# EAGLE design PoE_Mag-revG (EAGLE 9.0.1)
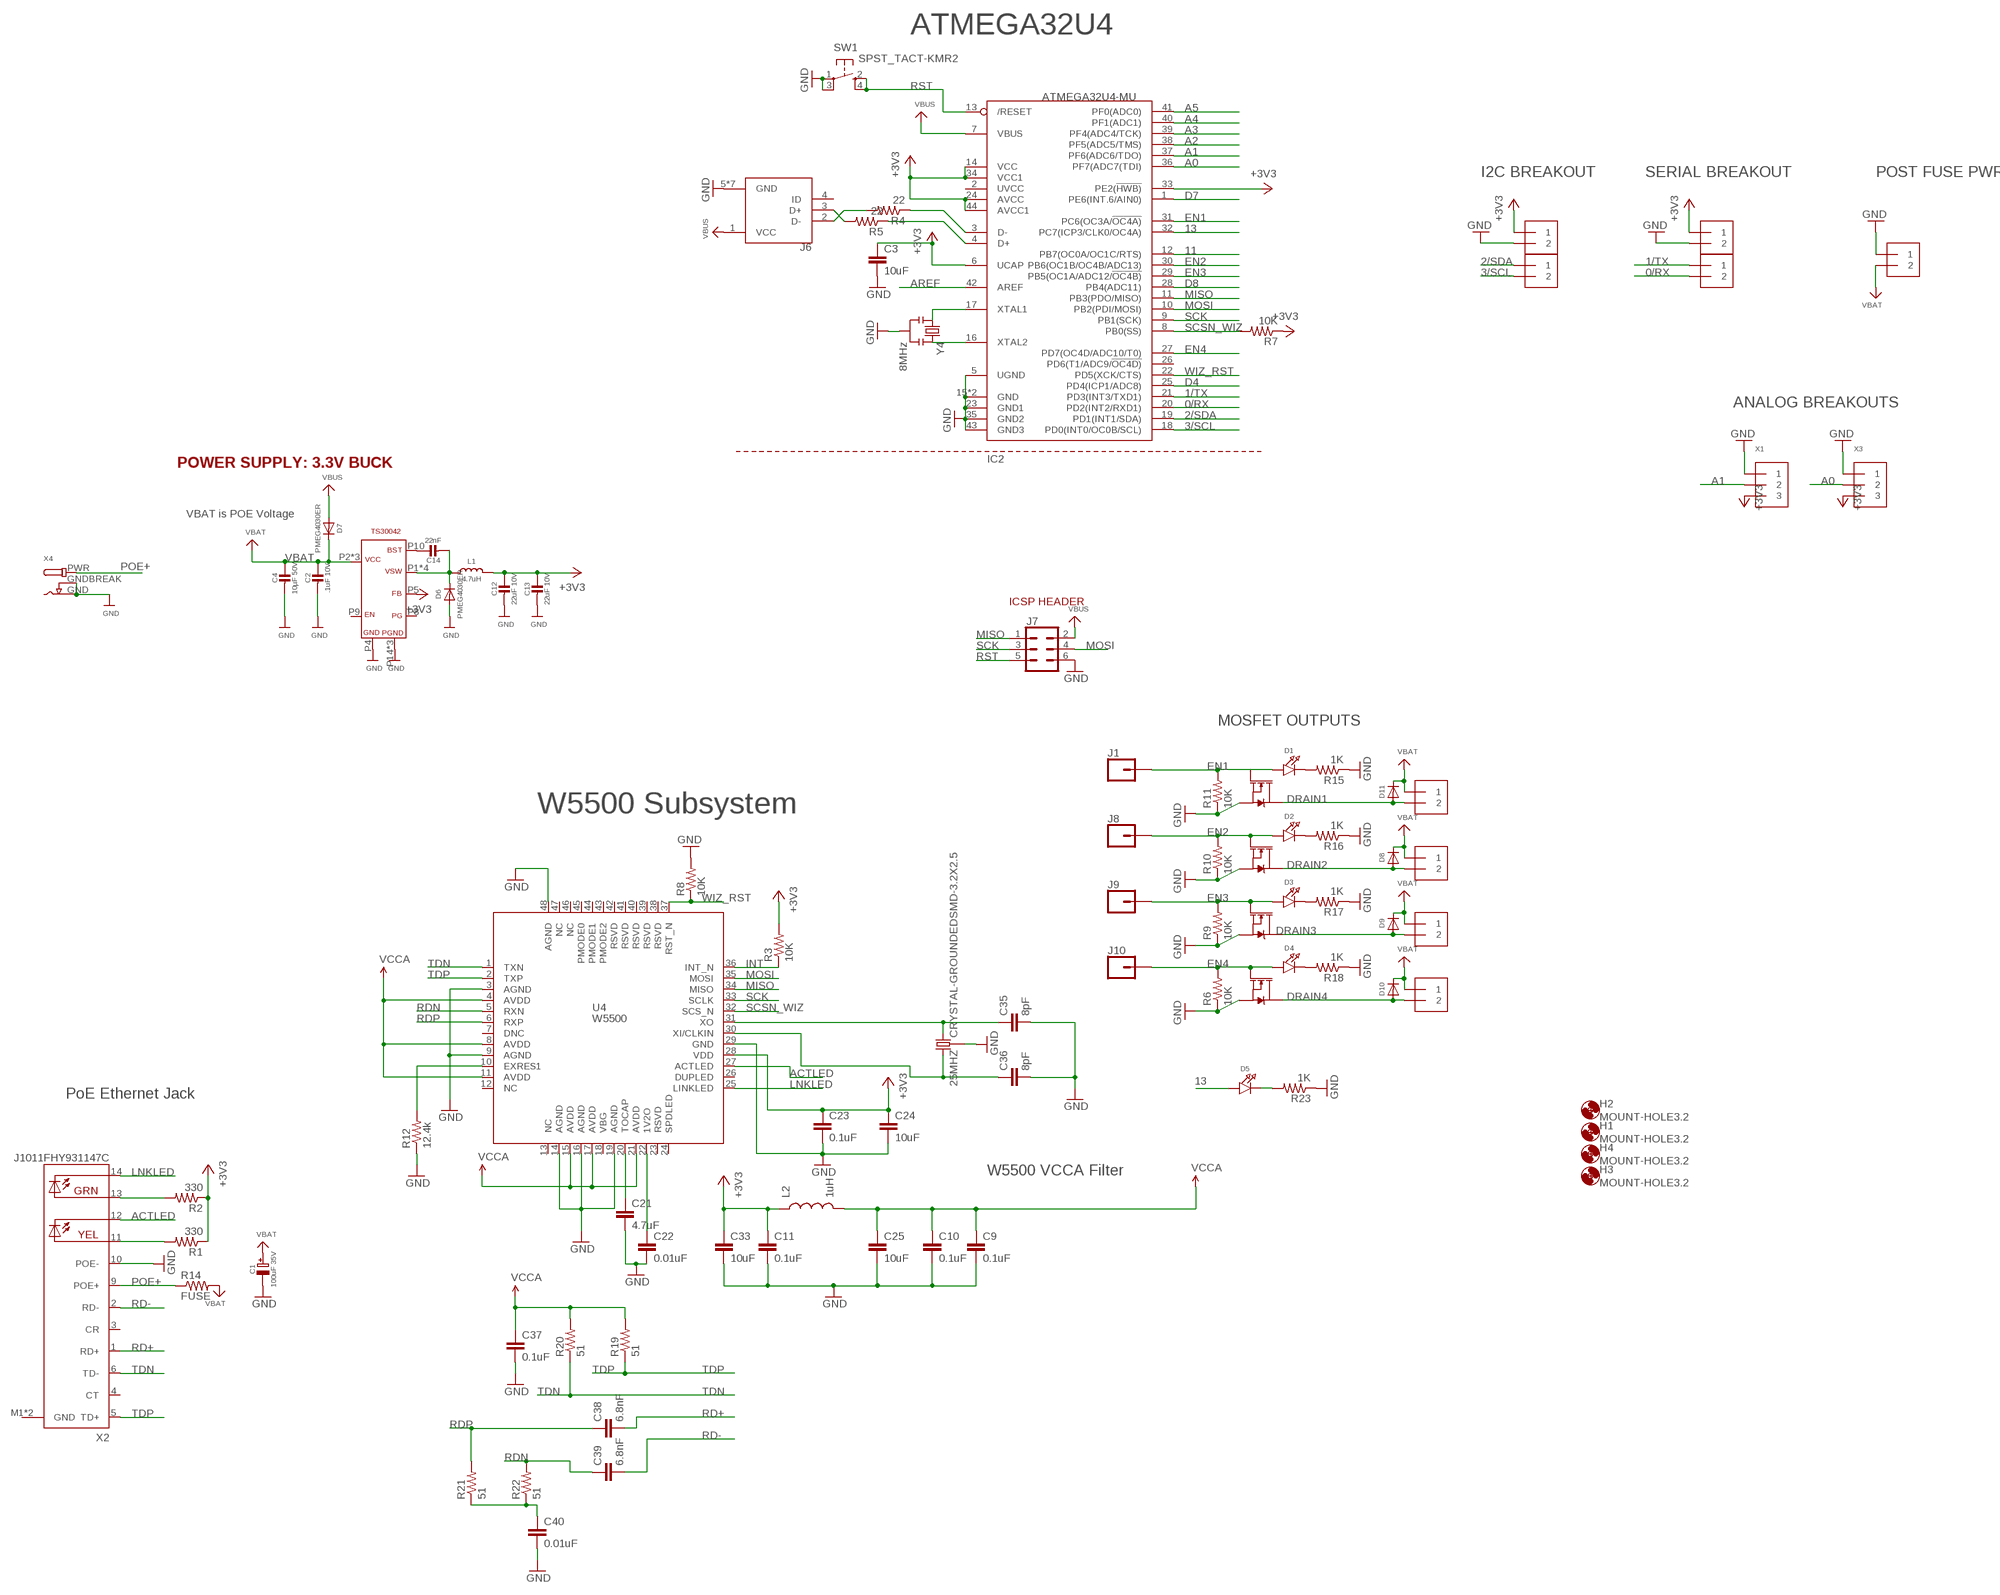
[diagram p0: schematic, sheet 1]

## Parts
25MHZ  CRYSTAL-GROUNDEDSMD-3.2X2.5  [CRYSTAL-SMD-3.2X2.5MM]
C1  100uF 35V  CAP_ELECTROLYTICPANASONIC_D  [PANASONIC_D]
C2  .1uF 10V  CAP_CERAMIC0603MINI  [0603-MINI]
C3  10uF  CAP0603-CAP  [0603-CAP]
C4  10µF 50V  CAP_CERAMIC_0805  [_0805]
C9  0.1uF  CAP0603-CAP  [0603-CAP]
C10  0.1uF  CAP0603-CAP  [0603-CAP]
C11  0.1uF  CAP0603-CAP  [0603-CAP]
C12  22uF 10V  CAP_CERAMIC0805-NOOUTLINE  [0805-NO]
C13  22uF 10V  CAP_CERAMIC0805-NOOUTLINE  [0805-NO]
C14  22nF  CAP_CERAMIC0603MINI  [0603-MINI]
C21  4.7uF  CAP0603-CAP  [0603-CAP]
C22  0.01uF  CAP0603-CAP  [0603-CAP]
C23  0.1uF  CAP0603-CAP  [0603-CAP]
C24  10uF  CAP0603-CAP  [0603-CAP]
C25  10uF  CAP0603-CAP  [0603-CAP]
C33  10uF  CAP0603-CAP  [0603-CAP]
C35  8pF  CAP0603-CAP  [0603-CAP]
C36  8pF  CAP0603-CAP  [0603-CAP]
C37  0.1uF  CAP0603-CAP  [0603-CAP]
C38  6.8nF  CAP0603-CAP  [0603-CAP]
C39  6.8nF  CAP0603-CAP  [0603-CAP]
C40  0.01uF  CAP0603-CAP  [0603-CAP]
D1  LED0805_NOOUTLINE  [CHIPLED_0805_NOOUTLINE]
D2  LED0805_NOOUTLINE  [CHIPLED_0805_NOOUTLINE]
D3  LED0805_NOOUTLINE  [CHIPLED_0805_NOOUTLINE]
D4  LED0805_NOOUTLINE  [CHIPLED_0805_NOOUTLINE]
D5  LED0805_NOOUTLINE  [CHIPLED_0805_NOOUTLINE]
D6  PMEG4030ER  DIODESOD-123  [SOD-123]
D7  PMEG4030ER  DIODESOD-123  [SOD-123]
D8  DIODESOD-123  [SOD-123]
D9  DIODESOD-123  [SOD-123]
D10  DIODESOD-123  [SOD-123]
D11  DIODESOD-123  [SOD-123]
H1  MOUNT-HOLE3.2  [3,2]
H2  MOUNT-HOLE3.2  [3,2]
H3  MOUNT-HOLE3.2  [3,2]
H4  MOUNT-HOLE3.2  [3,2]
IC2  ATMEGA32U4-MU  [TQFN44_7MM]
J1  CONN_01  [1X01]
J2  1X2-3.5MM  [1X2-3.5MM]
J3  1X2-3.5MM  [1X2-3.5MM]
J4  1X2-3.5MM  [1X2-3.5MM]
J5  1X2-3.5MM  [1X2-3.5MM]
J6  10103594-0001LF  [FCI_10103594-0001LF]
J7  CONN_03X2NO_SILK  [2X3-NS]
J8  CONN_01  [1X01]
J9  CONN_01  [1X01]
J10  CONN_01  [1X01]
J11  1X2-3.5MM  [1X2-3.5MM]
J14  1X2-3.5MM  [1X2-3.5MM]
J15  1X2-3.5MM  [1X2-3.5MM]
J16  1X2-3.5MM  [1X2-3.5MM]
J17  1X2-3.5MM  [1X2-3.5MM]
L1  4.7uH  INDUCTORTDK_VLC5045  [INDUCTOR_5X5MM_TDK_VLC5045]
L2  1uH  INDUCTOR0603  [0603]
Q1  35A/25V/8.5mΩ  MOSFET-NCH-FDD8780  [DPAK]
Q3  35A/25V/8.5mΩ  MOSFET-NCH-FDD8780  [DPAK]
Q5  35A/25V/8.5mΩ  MOSFET-NCH-FDD8780  [DPAK]
Q6  35A/25V/8.5mΩ  MOSFET-NCH-FDD8780  [DPAK]
R1  330  RESISTOR0603-RES  [0603-RES]
R2  330  RESISTOR0603-RES  [0603-RES]
R3  10K  RESISTOR0603-RES  [0603-RES]
R4  22  RESISTOR0603-RES  [0603-RES]
R5  22  RESISTOR0603-RES  [0603-RES]
R6  10K  RESISTOR0603-RES  [0603-RES]
R7  10K  RESISTOR0603-RES  [0603-RES]
R8  10K  RESISTOR0603-RES  [0603-RES]
R9  10K  RESISTOR0603-RES  [0603-RES]
R10  10K  RESISTOR0603-RES  [0603-RES]
R11  10K  RESISTOR0603-RES  [0603-RES]
R12  12.4k  RESISTOR0603-RES  [0603-RES]
R14  FUSE  RESISTOR0603-RES  [0603-RES]
R15  1K  RESISTOR0603-RES  [0603-RES]
R16  1K  RESISTOR0603-RES  [0603-RES]
R17  1K  RESISTOR0603-RES  [0603-RES]
R18  1K  RESISTOR0603-RES  [0603-RES]
R19  51  RESISTOR0603-RES  [0603-RES]
R20  51  RESISTOR0603-RES  [0603-RES]
R21  51  RESISTOR0603-RES  [0603-RES]
R22  51  RESISTOR0603-RES  [0603-RES]
R23  1K  RESISTOR0603-RES  [0603-RES]
SW1  SPST_TACT-KMR2  [KMR2]
U4  W5500  [W5500]
U$19  BUCK_CONVERTER  [QFN-16]
X1  TERMBLOCK_1X3  [TERMBLOCK_1X3-3.5MM]
X2  J1011FHY931147C  [HANRUN_POE]
X3  TERMBLOCK_1X3  [TERMBLOCK_1X3-3.5MM]
X4  DCBARRELPTH  [DCJACK_2MM_PTH]
Y4  8MHz  RESONATORSMD  [RESONATOR-SMD]

## Nets
0/RX: IC2.20(PD2(INT2/RXD1)) J17.2
1/TX: IC2.21(PD3(INT3/TXD1)) J17.1
2/SDA: IC2.19(PD1(INT1/SDA)) J15.1
3/SCL: IC2.18(PD0(INT0/OC0B/SCL)) J15.2
11: IC2.12(PB7(OC0A/OC1C/RTS))
13: D5.A IC2.32(PC7(ICP3/CLK0/OC4A))
+3V3: C3.1 C11.1 C12.1 C13.1 C23.1 C24.1 C33.1 IC2.6(UCAP) IC2.14(VCC) IC2.24(AVCC) IC2.33(PE2(!HWB)) IC2.34(VCC1) IC2.44(AVCC1) J14.1 J16.1 L1.P$2 L2.1 R1.1 R2.1 R3.2 R7.1 U4.28(VDD) U$19.P5(FB) X1.3 X3.3
A0: IC2.36(PF7(ADC7(TDI)) X3.2
A1: IC2.37(PF6(ADC6/TDO)) X1.2
A2: IC2.38(PF5(ADC5/TMS))
A3: IC2.39(PF4(ADC4/TCK))
A4: IC2.40(PF1(ADC1))
A5: IC2.41(PF0(ADC0))
ACTLED: U4.27(ACTLED) X2.12(YEL-C)
AREF: IC2.42(AREF)
D4: IC2.25(PD4(ICP1/ADC8))
D7: IC2.1(PE6(INT.6/AIN0))
D8: IC2.28(PB4(ADC11))
D+: IC2.4(D+) R5.1
D-: IC2.3(D-) R4.1
DRAIN1: D11.A J2.2 Q1.4(D)
DRAIN2: D8.A J3.2 Q3.4(D)
DRAIN3: D9.A J4.2 Q5.4(D)
DRAIN4: D10.A J5.2 Q6.4(D)
EN1: D1.A IC2.31(PC6(OC3A/!OC4A)) J1.1 Q1.1(G) R11.2
EN2: D2.A IC2.30(PB6(OC1B/OC4B/ADC13)) J8.1 Q3.1(G) R10.2
EN3: D3.A IC2.29(PB5(OC1A/ADC12/!OC4B)) J9.1 Q5.1(G) R9.2
EN4: D4.A IC2.27(PD7(OC4D/ADC10/T0)) J10.1 Q6.1(G) R6.2
GND: 25MHZ.2 25MHZ.4 C1.- C2.2 C3.2 C4.2 C9.2 C10.2 C11.2 C12.2 C13.2 C21.2 C22.2 C23.2 C24.2 C25.2 C33.2 C35.2 C36.2 C37.2 C40.2 D6.A IC2.5(UGND) IC2.15(GND) IC2.23(GND1) IC2.35(GND2) IC2.43(GND3) IC2.THERMAL(GND) J6.5(GND) J6.P1(GND) J6.P2(GND) J6.P3(GND) J6.P4(GND) J6.P5(GND) J6.P6(GND) J7.6 J11.1 J14.2 J16.2 Q1.3(S) Q3.3(S) Q5.3(S) Q6.3(S) R6.1 R8.2 R9.1 R10.1 R11.1 R12.1 R15.1 R16.1 R17.1 R18.1 R23.1 SW1.1(P) SW1.3(P1) U4.3(AGND) U4.9(AGND) U4.14(AGND) U4.16(AGND) U4.19(AGND) U4.29(GND) U4.48(AGND) U$19.P4(GND) U$19.P14(PGND) U$19.P15(PGND) U$19.PAD(PGND) X1.1 X2.10(POE-) X3.1 X4.GND X4.GNDBREAK Y4.2
INT: R3.1 U4.36(INT_N)
LNKLED: U4.25(LINKLED) X2.14(GRN-C)
MISO: IC2.11(PB3(PDO/MISO)) J7.1 U4.34(MISO)
MOSI: IC2.10(PB2(PDI/MOSI)) J7.4 U4.35(MOSI)
N$3: R2.2 X2.13(GRN-A)
N$4: R1.2 X2.11(YEL-A)
N$5: D1.C R15.2
N$6: J6.3(D+) R5.2
N$7: D2.C R16.2
N$8: D3.C R17.2
N$9: D4.C R18.2
N$10: D5.C R23.2
N$11: IC2.16(XTAL2) Y4.3
N$12: IC2.17(XTAL1) Y4.1
N$13: J6.2(D-) R4.2
N$14: C14.1 U$19.P10(BST)
N$16: C14.2 D6.C L1.P$1 U$19.P1(VSW) U$19.P12(VSW) U$19.P13(VSW) U$19.P16(VSW)
N$18: C21.1 U4.20(TOCAP)
N$19: C22.1 U4.22(1V2O)
N$20: R12.2 U4.10(EXRES1)
N$23: C40.1 R21.1 R22.1
N$25: 25MHZ.3 C35.1 U4.31(XO)
N$26: 25MHZ.1 C36.1 U4.30(XI/CLKIN)
POE+: R14.1 X2.9(POE+) X4.PWR
RD+: C38.2 X2.1(RD+)
RD-: C39.2 X2.2(RD-)
RDN: C39.1 R22.2 U4.5(RXN)
RDP: C38.1 R21.2 U4.6(RXP)
RST: IC2.13(/RESET) J7.5 SW1.2(S) SW1.4(S1)
SCK: IC2.9(PB1(SCK)) J7.3 U4.33(SCLK)
SCSN_WIZ: IC2.8(PB0(SS)) R7.2 U4.32(SCS_N)
TDN: R20.1 U4.1(TXN) X2.6(TD-)
TDP: R19.1 U4.2(TXP) X2.5(TD+)
VBAT: C1.+ C2.1 C4.1 D7.C D8.C D9.C D10.C D11.C J2.1 J3.1 J4.1 J5.1 J11.2 R14.2 U$19.P2(VCC) U$19.P3(VCC) U$19.P11(VCC)
VBUS: D7.A IC2.7(VBUS) J6.1(VCC) J7.2
VCCA: C9.1 C10.1 C25.1 C37.1 L2.2 R19.2 R20.2 U4.4(AVDD) U4.8(AVDD) U4.11(AVDD) U4.15(AVDD) U4.17(AVDD) U4.21(AVDD)
WIZ_RST: IC2.22(PD5(XCK/CTS)) R8.1 U4.37(RST_N)
Unconnected: IC2.2(UVCC) IC2.26(PD6(T1/ADC9/!OC4D)) J6.4(ID) U4.7(DNC) U4.12(NC) U4.13(NC) U4.18(VBG) U4.23(RSVD) U4.24(SPDLED) U4.26(DUPLED) U4.38(RSVD) U4.39(RSVD) U4.40(RSVD) U4.41(RSVD) U4.42(RSVD) U4.43(PMODE2) U4.44(PMODE1) U4.45(PMODE0) U4.46(NC) U4.47(NC) U$19.P8(PG) U$19.P9(EN) X2.3(CR) X2.4(CT)

## Notes on the sheet
- ATMEGA32U4
- I2C BREAKOUT | SERIAL BREAKOUT | POST FUSE PWR
- ANALOG BREAKOUTS
- POWER SUPPLY: 3.3V BUCK
- VBAT is POE Voltage
- ICSP HEADER
- MOSFET OUTPUTS
- W5500 Subsystem
- PoE Ethernet Jack
- W5500 VCCA Filter

## Power pins joined to a net without a drawn wire
GND: X2.M1(GND) X2.M2(GND)

## Library data of the parts
25MHZ = SparkFun-Clocks:CRYSTAL-GROUNDED: Crystals w/ Ground Pin (Generic) These are passive quartz crystals, which can be used as a clock source for a microcontroller. Crystal's are usually two-terminal devices. A third terminal may be optionally connected to ground, as recommended by the manufaturer.
C1 = microbuilder:CAP_ELECTROLYTIC: Electrolytic Capacitors SMT PANASONIC_C - Size C Panasonic Electrolytic Aluminum Capacitor 47µF 16V 20% Electrolytic Capacitor [Digikey: PCE3890TR-ND] PANASONIC_D - Size D Panasonic Electrolytic Aluminum Capacitor 100µF 25V 20% Electrolytic Capacitor [Digikey: PCE3898TR-ND] PTH 3.5 mm grid, 8 mm diameter ... 3.5 mm grid, 10 mm diameter ...
C2 C4 C12-C14 = microbuilder:CAP_CERAMIC: Ceramic Capacitors For new designs, use the packages preceded by an '_' character since they are more reliable: The following footprints should be used on most boards: _0402 - Standard footprint for regular board layouts _0603 - Standard footprint for regular board layouts _0805 - Standard footprint for regular board layouts _1206 - Standard footprint for regular board layouts For extremely tight-pitch boards where space is at a premium, the following 'micro-pitch' footprints can be used (smaller pads, no silkscreen outline, etc.): _0402MP - Micro-pitch footprint for very dense/compact boards _0603MP - Micro-pitch footprint for very dense/compact boards _0805MP - Micro-pitch footprint for very dense/compact boards _1206MP - Micro-pitch footprint for very dense/compact boards
C3 C9-C11 C21-C25 C33 C35-C40 = SparkFun-Passives:CAP: Capacitor Standard 0603 ceramic capacitor, and 0.1" leaded capacitor.
D1-D5 = microbuilder:LED: LED 0603 - 0603 Surface Mount Package 2mA: Green LED - Low Power (3.9mcd, 2ma, 1.7Vf) - Digikey: 475-2709-2-ND Orange LED - Low Power (9.8mcd, 2ma, 1.8Vf) - Digikey: 475-1194-2-ND Red LED - Low Power (5mcd, 2ma, 1.8Vf) - Digikey: 475-1195-2-ND Yellow LED - Low Power (7mcd, 2ma, 1.8Vf) - Digikey: 475-1196-2-ND 5mA: Blue LED - Low Power (17mcd, 5ma, 2.9Vf) - Digikey: LNJ937W8CRACT-ND 0805 - 0805 Surface Mount Package 2mA: Red LED (8.8mcd, 2mA, 1.8Vf, Clear) - Low Power [Digikey: 475-2510-1-ND] Green LED (5mcd, 2mA, 1.8Vf, Clear) - Low Power [Digikey: 475-2730-1-ND] Yellow LED (11.3mcd, 2mA, 1.8Vf, Clear) - Low Power [Digikey: 475-2555-1-ND] 20mA: Red LED (104mcd, 20mA, Diffused) - LS R976 [Digikey: 475-1278-6-ND] Red LED (12mcd, 20mA, 2.0Vf, Clear) - APT2012EC [Digikey: 754-1128-1-ND] Green LED (15mcd, 20mA, 2.2Vf, Clear) - APT2012GC [Digikey: 754-1131-1-ND] Orange LED (160mcd, 20mA, 2.1Vf, Clear) - APT2012SECK [Digikey: 754-1130-1-ND] 1206 - 1206 Surface Mount Package Green LED (26mcd, 20mA, Diffused) - LG N971 [Digikey: 475-1407-6-ND] Red LED (15mcd, 20mA, Diffused) - LH N974 [Digikey: 475-1416-6-ND] Cree - Cree High-Power Surface Mount LEDs XPEBWT-L1-0000-00D50 - White 111lm 350mA 2.9Vf 6200K 110° XTEAWT-00-0000-00000LEE3 - White 114lm 350mA 2.85Vf 5000K 115° Everlight - Everlight 45-21 Series Surface Mount LEDs 45-21/QK2C-B2832AC2CB2/2T - Warm White 2000mcd 20mA 3.25Vf 3050K 120° 45-21/LK2C-B38452C4CB2/2T - Nuetral White 2000mcd 20mA 3.25Vf 4150K 120° 45-21/LK2C-B50634C6CB2/2T - Cold White 2200mcd 20mA 3.25Vf 5650K 120° PLCC2 Reverse Mount LS T77K-J1L2-1-0-2-R18-Z - Red 11.25mcd 2mA 1.8Vf 630nm 120° LO T77K-L1M2-24-Z - Orange 19.6mcd 2mA 1.8Vf 606nm 120° LY T77K-K2M1-26-Z - Yellow 15.7mcd 2mA 1.8Vf 587nm 120°
D6-D11 = microbuilder:DIODE: Diode SMA Model Volts Amps Type Vf Ir Digikey # Notes SSA34-E3 40V 3A Schottky 480mV @ 3A 200uA @ 40V SSA34-E3/61TGITR-ND CDBA120-G 20V 1A Schottky 500mV @ 1A 500uA @ 20V 641-1014-6-ND REEL MBRA210 10V 2A Schottky 350mV @ 2A 700uA @ 10V MBRA210LT3 SOD-123 Model Volts Amps Type Vf Ir Order # Notes BAT54T1G 30V 200mA Schottky 800mV @ 200mA 2uA @ 25V BAT54T1GOSTR-ND B0530W 30V 500mA Schottky 430mV @ 500mA 130uA @ 30V B0530W-FDICT-ND REEL MBR120 20V 1A Schottky 340mV @ 1A MBR120VLSFT1GOSCT-ND SOD-323 Model Volts Amps Type Vf Ir Order # Notes PMEG2005EJ 20V 500mA Schottky 355mV @ 500mA 568-4110-1-ND ZLLS410 10V 570mA Schottky 380mV @ 570mA ZLLS410CT-ND 1N4148WS 75V 150mA Silicon/Simple 1V 1N4148WSFSCT-ND REEL SOD-523 Model Volts Amps Type Vf Ir Order # Notes BAT54XV2 30V 200mA Schottky 0.8V @ 100mA BAT54XV2CT-ND TB751S 30V 30mA Schottky RB751S-40TE61CT-ND SOT23-R/W (R = Solder Paste/Reflow Ovens, W = Hand-Soldering) Model Volts Amps Type Vf Ir Order # Notes BAT54FILM 40V 300mA Schottky 497-7162-1-ND POWERDI-5 Model Volts Amps Type Vf Ir Order # Notes PDS560 60V 5A Schottky 670mV @ 5A 150uA @ 60V PDS560DICT-ND
H1-H4 = holes:MOUNT-HOLE: MOUNTING HOLE with drill center marker
IC2 = microbuilder:ATMEGA32U4: http://www.ladyada.net/library/eagle
J1 J8-J10 = SparkFun-Connectors:CONN_01: Single connection point. Often used as Generic Header-pin footprint for 0.1 inch spaced/style header connections On any of the 0.1 inch spaced packages, you can populate with these: Break Away Headers - Straight <https://www.sparkfun.com/products/116> (PRT-00116) Break Away Male Headers - Right Angle <https://www.sparkfun.com/products/553> (PRT-00553) Female Headers <https://www.sparkfun.com/products/115> (PRT-00115) Break Away Headers - Machine Pin <https://www.sparkfun.com/products/117> (PRT-00117) Break Away Female Headers - Swiss Machine Pin <https://www.sparkfun.com/products/743> (PRT-00743) This device is also useful as a general connection point to wire up your design to another part of your project. Our various solder wires solder well into these plated through hole pads. Hook-Up Wire - Assortment (Stranded, 22 AWG) <https://www.sparkfun.com/products/11375> (PRT-11375) Hook-Up Wire - Assortment (Solid Core, 22 AWG) <https://www.sparkfun.com/products/11367> (PRT-11367) View the entire wire category on our website here <https://www.sparkfun.com/categories/141> Special notes: SMTSO-256-ET is a "flush mount" nut for a 4-40 screw. We mostly use this on specialty testbeds; it is a nice way to connect hardware to your PCB at an adjustable hieght. Also note, the SNAP packages are for using a snappable style connector. We sell a baggie of snaps and they are also used on two LilyPad designs: Snap Assortment - 30 pack (male and female) <https://www.sparkfun.com/products/11347> (DEV-11347) LilyPad Arduino SimpleSnap <https://www.sparkfun.com/products/10941> (DEV-10941) LilyPad SimpleSnap Protoboard <https://www.sparkfun.com/products/10940> (DEV-10940)
J2-J5 J11 J14-J17 = adafruit:1X2: 3.5mm Terminal block http://www.ladyada.net/library/pcb/eaglelibrary.html
J6 = 10103594-0001LF:10103594-0001LF: Conn Micro USB Type B RCP 5 POS 0.65mm Solder RA SMD 5 Terminal 1 Port T/R; AVAILABILITY: Good; DESCRIPTION: Conn Micro USB Type B RCP 5 POS 0.65mm Solder RA SMD 5 Terminal 1 Port T/R; MF: FCI; MP: 10103594-0001LF; PACKAGE: None; PRICE: 0.40 USD
J7 = SparkFun-Connectors:CONN_03X2: Multi connection point. Often used as Generic Header-pin footprint for 0.1 inch spaced/style header connections You can populate with any combo of single row headers, but if you'd like an exact match, check these: Header - 2x3 (Male, 0.1") <https://www.sparkfun.com/products/12807> (PRT-12807) Header - 2x3 (Female, 0.1") <https://www.sparkfun.com/products/13010> (PRT-13010) 2x3 Pin Shrouded Header <https://www.sparkfun.com/products/10877> (PRT-10877) On any of the 0.1 inch spaced packages, you can populate with these: Break Away Headers - Straight <https://www.sparkfun.com/products/116> (PRT-00116) Break Away Male Headers - Right Angle <https://www.sparkfun.com/products/553> (PRT-00553) Female Headers <https://www.sparkfun.com/products/115> (PRT-00115) Break Away Headers - Machine Pin <https://www.sparkfun.com/products/117> (PRT-00117) Break Away Female Headers - Swiss Machine Pin <https://www.sparkfun.com/products/743> (PRT-00743) Special note: the shrouded connector mates well with our 3x2 ribbon cables: Ribbon Crimp Connector - 6-pin (2x3, Female) <https://www.sparkfun.com/products/10651> (PRT-10651) Ribbon Cable - 6 wire (15ft) <https://www.sparkfun.com/products/10646> (PRT-10646)
L1 = microbuilder:INDUCTOR: Inductors
L2 = SparkFun-Passives:INDUCTOR: Inductors
Q1 Q3 Q5 Q6 = SparkFun-DiscreteSemi:MOSFET-NCH: N-channel MOSFETs Voltage controlled devices that allow control of high current outputs. SparkFun Products: SparkFun OpenScale <https://www.sparkfun.com/products/13261> SparkFun Digital Sandbox <https://www.sparkfun.com/products/12651> SparkFun Monster Moto Shield <https://www.sparkfun.com/products/10182> SparkFun MOSFET Power Controller <https://www.sparkfun.com/products/11214>; PROD_ID: TRANS-09984
R1-R12 R14-R23 = SparkFun-Passives:RESISTOR: Resistor Basic schematic elements and footprints for 0603, 1206, and PTH resistors.
SW1 = adafruit:SPST_TACT: SMT 6mm switch, EVQQ2 series http://www.ladyada.net/library/eagle
U4 = W5500:W5500
U$19 = Heep:BUCK_CONVERTER
X1 X3 = microbuilder:TERMBLOCK_1X3: 3.5mm Terminal block http://www.ladyada.net/library/pcb/eaglelibrary.html
X2 = Heep:J1011F: PULSEJACK (TM) 1x1 Tab-UP RJ45 10/100 Base-TX RJ45 1x1 Tab-UP with LEDs 8-pin (J1 series) and 6-pin (JP series) integrated magnetics connector, designed to support applications, such as ADSL modems, LAN-on-Motherboard, and Hub and Switches. Source: www.pulseeng.com .. PulseJack-J402.pdf
X4 = microbuilder:DCBARREL: DC Barrel Jack DCJACK_1.3MM_PTH - Through Hole 1.3mm Jack (4UConnector: 05536) DCJACK_2MM_PTH - Through Hole 2.0/2.1 Jack (4UConnector: 05537) DCJACK_2MM_SMT - SMT 2.0/2.1mm Jack(4UConnector: 03267)
Y4 = SparkFun:RESONATOR: Resonator Small SMD resonator. This is the itty bitty 10/20MHz resonators with built in caps. CSTCE10M0G55 and CSTCE20M0V53. Footprint has been reviewed closely but hasn't been tested yet.

## Net classes
3 usbvcc: width 0.305 mm, drill 0.483 mm, clearance 0.203 mm

## Board
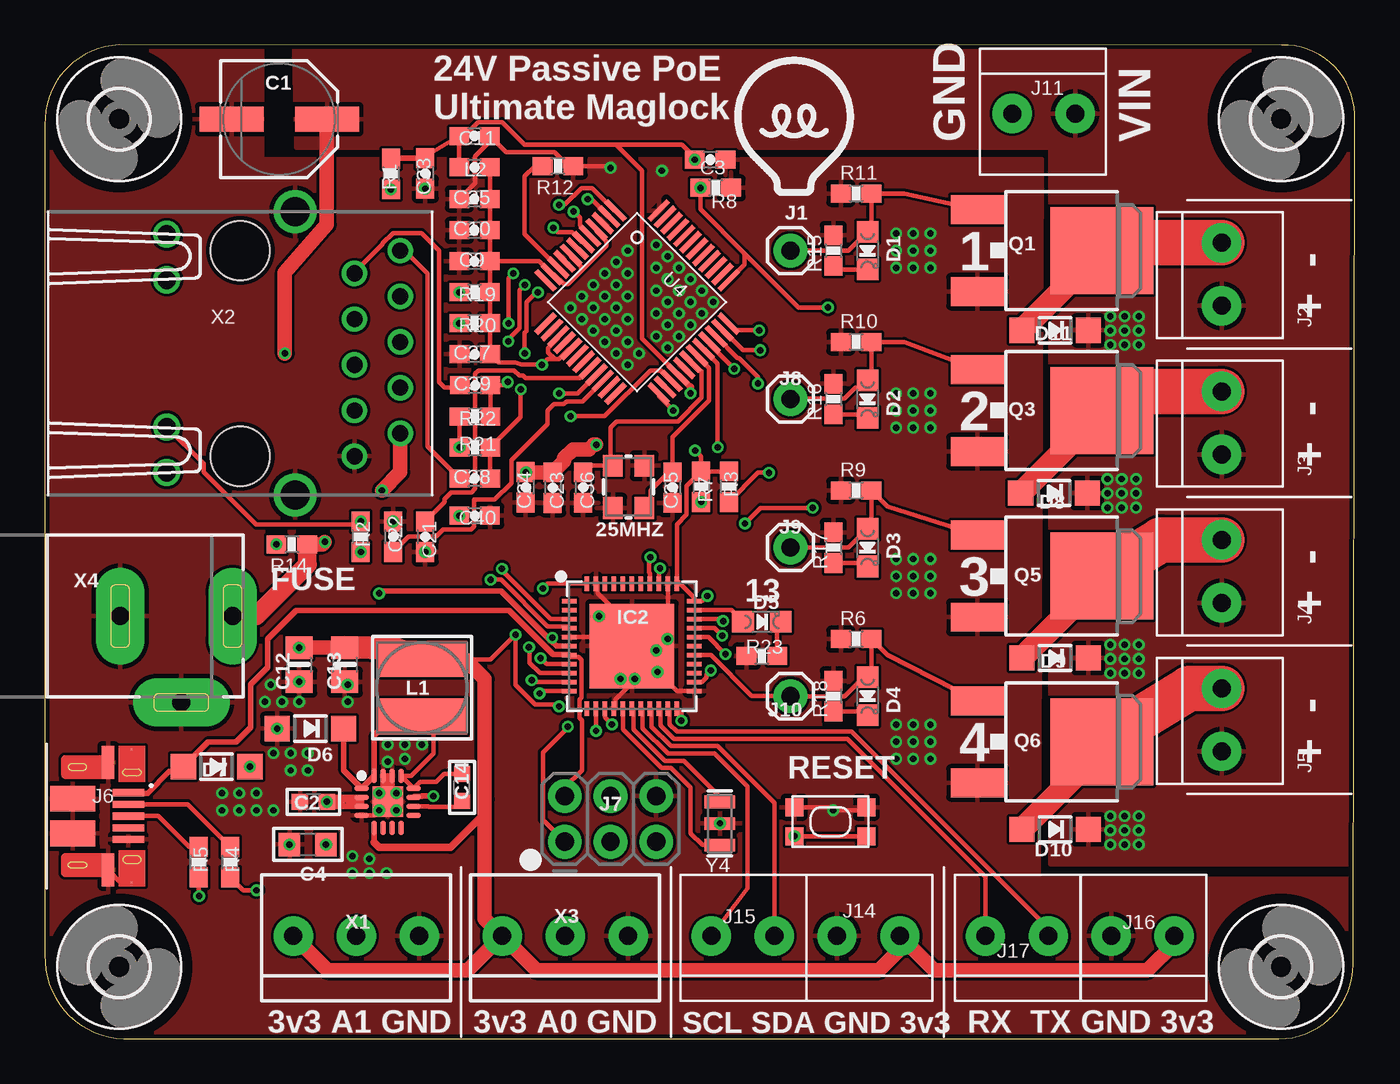
[diagram p1: board, top side]
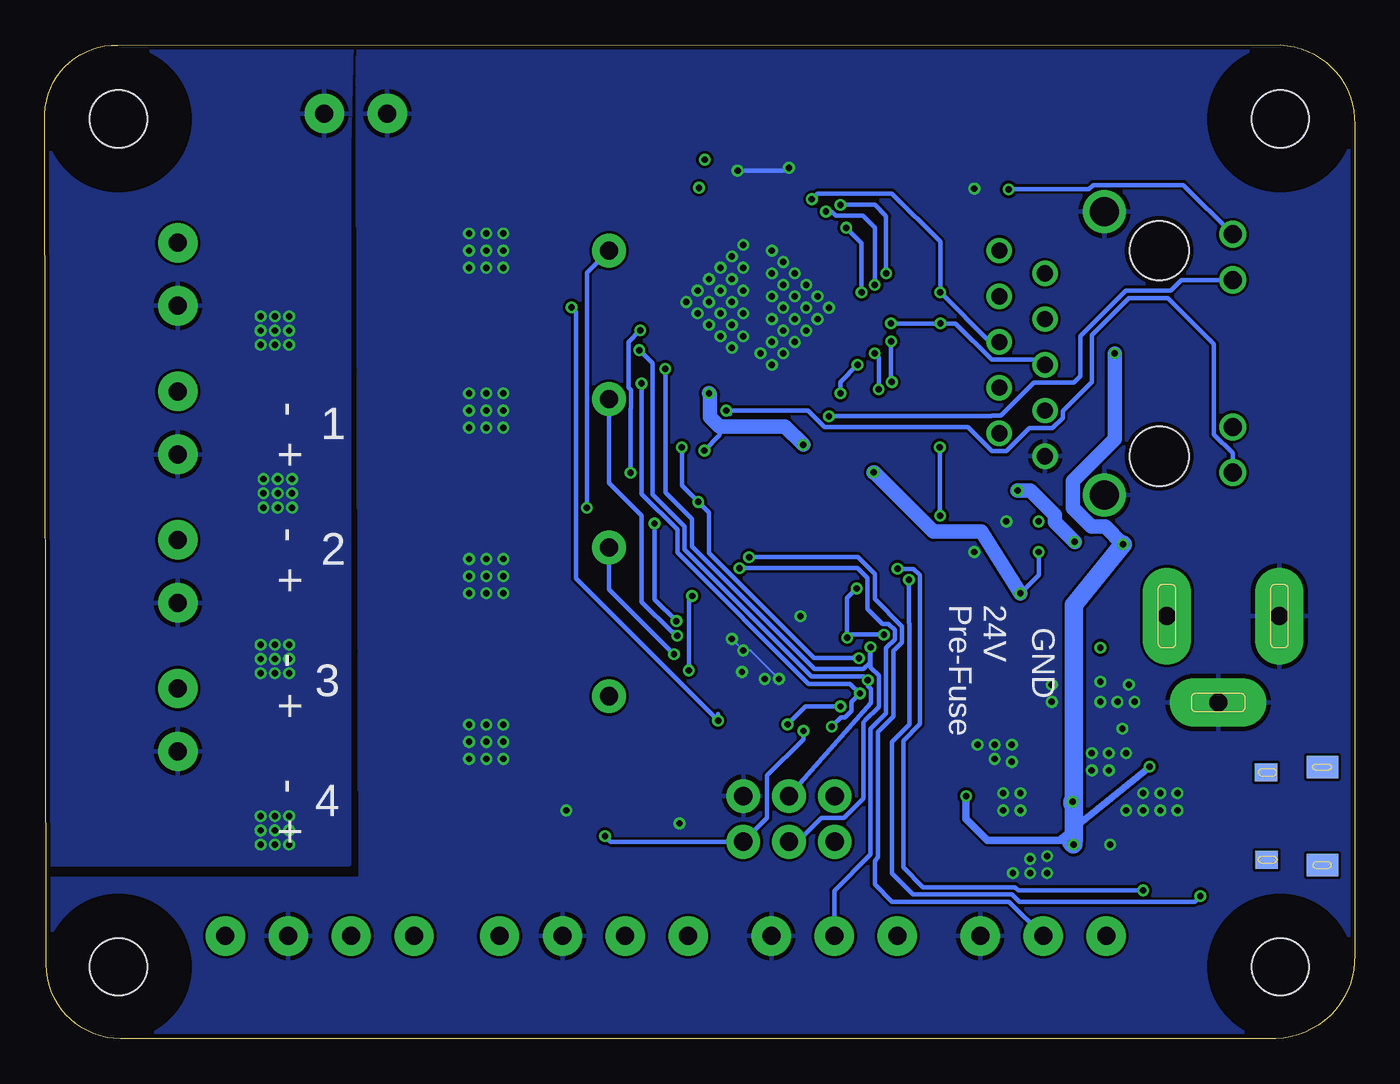
[diagram p2: board, bottom side, seen from below]

Size 72.79 x 55.24 mm. Coordinates in mm from the lower left corner, seen from the top.
Outline: 4.37,0 68.58,0 arc90 72.71,4.13 72.79,51.43 arc90 68.74,55.23 4.13,55.24 arc90 0,50.8 0,4.68 arc90 4.37,0
Copper layers (1*16): Top 0.035mm / dielectric 1.5mm / Bottom 0.035mm
Design rules "SeeedStudio_2layer_DRU_no_angle_20140221": minimum track width 6mil, minimum drill 12mil, track to track 6mil, track to pad 6mil, pad to pad 6mil, via to via 6mil, smd to smd 0mil, copper to edge 10mil, drill to drill 10mil, minimum pad ring 10mil, minimum via ring 6mil, stop-mask expansion 2mil, vias tented up to drill 100mil, thermal gap 10mil

### Footprints (pad centres in the part's own frame; a part is rotated, then mirrored left to right if it is on the bottom)
CRYSTAL-SMD-3.2X2.5MM = smd 1.2 x 1.1: 1 -1.175,-0.875; 2 1.175,-0.875; 3 1.175,0.875; 4 -1.175,0.875
PANASONIC_D = smd 3.556 x 1.4: + 2.654,0; - -2.654,0
0603-MINI = smd 0.9 x 0.9: 1 -0.75,0; 2 0.75,0
0603-CAP = smd 1.1 x 1: 1 -0.85,0; 2 0.85,0
_0805 = smd 1.2 x 1.3: 1 -1.016,0; 2 1.016,0
0805-NO = smd 1.24 x 1.5: 1 -0.95,0; 2 0.95,0
CHIPLED_0805_NOOUTLINE = smd 1.2 x 1.2: A 0,-1.05; C 0,1.05
SOD-123 = smd 1.4 x 1.4: A 1.85,0; C -1.85,0
3,2 = hole 3.2: 0,0
TQFN44_7MM = smd 0.25 x 0.8: 1 -2.5,-3.475; 2 -2,-3.475; 3 -1.5,-3.475; 4 -1,-3.475; 5 -0.5,-3.475; 6 0,-3.475; 7 0.5,-3.475; 8 1,-3.475; 9 1.5,-3.475; 10 2,-3.475; 11 2.5,-3.475; 23 2.5,3.475; 24 2,3.475; 25 1.5,3.475; 26 1,3.475; 27 0.5,3.475; 28 0,3.475; 29 -0.5,3.475; 30 -1,3.475; 31 -1.5,3.475; 32 -2,3.475; 33 -2.5,3.475 | smd 0.8 x 0.25: 12 3.475,-2.5; 13 3.475,-2; 14 3.475,-1.5; 15 3.475,-1; 16 3.475,-0.5; 17 3.475,0; 18 3.475,0.5; 19 3.475,1; 20 3.475,1.5; 21 3.475,2; 22 3.475,2.5; 34 -3.475,2.5; 35 -3.475,2; 36 -3.475,1.5; 37 -3.475,1; 38 -3.475,0.5; 39 -3.475,0; 40 -3.475,-0.5; 41 -3.475,-1; 42 -3.475,-1.5; 43 -3.475,-2; 44 -3.475,-2.5 | smd 4.7 x 4.7: THERMAL 0,0
1X01 = drill 1.016 pad 1.88: 1 0,0
1X2-3.5MM = drill 1 pad 2.184: 1 1.8,0; 2 -1.7,0
FCI_10103594-0001LF = smd 0.4 x 1.75: 1 -1.3,2.825; 2 -0.65,2.825; 3 0,2.825; 4 0.65,2.825; 5 1.3,2.825 | smd 0.1 x 0.1: P1 -3.7,3; P2 3.7,3 | smd 1.825 x 0.7: P3 -2.987,1.7; P4 2.987,1.7 | smd 1.425 x 2.5: P5 -0.963,-0.25; P6 0.963,-0.25 | smd 1.25 x 1.75 bottom: P$1 -2.731,-0.026; P$2 2.726,-0.018 | smd 1 x 1.25 bottom: P$3 -2.422,3.111; P$4 2.427,3.078
2X3-NS = drill 1.016 pad 1.88: 1 -2.54,-1.27; 2 -2.54,1.27; 3 0,-1.27; 4 0,1.27; 5 2.54,-1.27; 6 2.54,1.27
INDUCTOR_5X5MM_TDK_VLC5045 = smd 2 x 5: P$1 -1.6,0; P$2 1.6,0
0603 = smd 1.1 x 1: 1 -0.85,0; 2 0.85,0
DPAK = smd 1.6 x 3: 1 -2.28,-5.31; 3 2.28,-5.31 | smd 4.826 x 5.715: 4 0,1.588
0603-RES = smd 1.1 x 1: 1 -0.85,0; 2 0.85,0
KMR2 = smd 1 x 1: 1 2,0.8; 2 2,-0.8; 3 -2,0.8; 4 -2,-0.8
W5500 = smd 1.5 x 0.3: 1 -4.45,2.75; 2 -4.45,2.25; 3 -4.45,1.75; 4 -4.45,1.25; 5 -4.45,0.75; 6 -4.45,0.25; 7 -4.45,-0.25; 8 -4.45,-0.75; 9 -4.45,-1.25; 10 -4.45,-1.75; 11 -4.45,-2.25; 12 -4.45,-2.75; 25 4.45,-2.75; 26 4.45,-2.25; 27 4.45,-1.75; 28 4.45,-1.25; 29 4.45,-0.75; 30 4.45,-0.25; 31 4.45,0.25; 32 4.45,0.75; 33 4.45,1.25; 34 4.45,1.75; 35 4.45,2.25; 36 4.45,2.75 | smd 0.3 x 1.5: 13 -2.75,-4.45; 14 -2.25,-4.45; 15 -1.75,-4.45; 16 -1.25,-4.45; 17 -0.75,-4.45; 18 -0.25,-4.45; 19 0.25,-4.45; 20 0.75,-4.45; 21 1.25,-4.45; 22 1.75,-4.45; 23 2.25,-4.45; 24 2.75,-4.45; 37 2.75,4.45; 38 2.25,4.45; 39 1.75,4.45; 40 1.25,4.45; 41 0.75,4.45; 42 0.25,4.45; 43 -0.25,4.45; 44 -0.75,4.45; 45 -1.25,4.45; 46 -1.75,4.45; 47 -2.25,4.45; 48 -2.75,4.45
QFN-16 = smd 0.8 x 0.3: P1 -1.45,0.75; P2 -1.45,0.25; P3 -1.45,-0.25; P4 -1.45,-0.75; P9 1.45,-0.75; P10 1.45,-0.25; P11 1.45,0.25; P12 1.45,0.75 | smd 0.3 x 0.8: P5 -0.75,-1.45; P6 -0.25,-1.45; P7 0.25,-1.45; P8 0.75,-1.45; P13 0.75,1.45; P14 0.25,1.45; P15 -0.25,1.45; P16 -0.75,1.45 | smd 1.7 x 1.7: PAD 0,0
TERMBLOCK_1X3-3.5MM = drill 1 pad 2.184: 1 3.5,0; 2 0,0; 3 -3.5,0
HANRUN_POE = drill 0.9 pad 1.3: 1 5.715,-8.89; 2 4.445,-6.35; 3 3.175,-8.89; 4 1.905,-6.35; 5 0.635,-8.89; 6 -0.635,-6.35; 7 -1.905,-8.89; 8 -3.175,-6.35; 9 -4.445,-8.89; 10 -5.715,-6.35 | drill 1 pad 1.422: 11 6.625,4.08; 12 4.085,4.08; 13 -4.085,4.08; 14 -6.625,4.08 | drill 1.6 pad 2.184: M1 7.875,-3.05; M2 -7.875,-3.05 | hole 3.3: -5.715,0; 5.715,0
DCJACK_2MM_PTH = drill 1 pad 2.7 long: GND 7.35,0; GNDBREAK 10.75,-4.8; PWR 13.6,0
RESONATOR-SMD = smd 0.7 x 1.7: 1 -1.2,0; 2 0,0; 3 1.2,0

### Placement (x,y rotation side)
25MHZ  32.44,30.68 270 top
C1  13.02,51.12 0 top
C2  14.92,13.18 180 top
C3  36.97,48.87 0 top
C4  14.61,10.79 180 top
C9  23.88,43.22 180 top
C10  23.88,44.95 180 top
C11  23.88,50.18 0 top
C12  14.13,20.8 270 top
C13  16.67,20.8 270 top
C14  23.18,13.97 90 top
C21  21.13,27.91 270 top
C22  19.36,27.91 90 top
C23  28.22,30.64 270 top
C24  26.72,30.66 270 top
C25  23.88,46.68 180 top
C33  21.13,48.1 270 top
C35  34.88,30.65 270 top
C36  29.91,30.65 270 top
C37  23.89,38.06 180 top
C38  23.89,31.15 180 top
C39  23.91,36.33 180 top
C40  23.88,29.08 0 top
D1  45.72,43.81 180 top
D2  45.72,35.56 180 top
D3  45.72,27.31 180 top
D4  45.72,19.05 180 top
D5  39.85,23.18 270 top
D6  14.76,17.24 180 top
D7  9.54,15.13 180 top
D8  56.08,30.34 180 top
D9  56.14,21.17 180 top
D10  56.14,11.64 180 top
D11  56.14,39.38 180 top
H1  68.7,51.12 0 top
H2  4.13,4 270 top
H3  4.13,51.12 0 top
H4  68.7,4 0 top
IC2  32.62,21.83 270 top
J1  41.43,43.81 0 top
J2  65.41,42.54 270 top
J3  65.41,34.29 270 top
J4  65.41,26.04 270 top
J5  65.41,17.78 270 top
J6  1.8,12.38 270 top
J7  31.43,12.22 0 top
J8  41.43,35.56 0 top
J9  41.43,27.31 0 top
J10  41.43,19.05 0 top
J11  55.56,51.43 180 top
J14  45.72,5.71 0 top
J15  38.73,5.71 0 top
J16  60.96,5.71 0 top
J17  53.98,5.71 0 top
L1  20.95,19.53 90 top
L2  23.88,48.44 0 top
Q1  57.15,43.81 270 top
Q3  57.15,34.92 270 top
Q5  57.15,25.72 270 top
Q6  57.15,16.51 270 top
R1  19.23,48.07 270 top
R2  17.55,27.91 90 top
R3  38.01,30.7 90 top
R4  10.3,9.82 90 top
R5  8.54,9.82 90 top
R6  45.09,22.23 0 top
R7  36.48,30.7 270 top
R8  37.29,47.31 0 top
R9  45.09,30.48 0 top
R10  45.09,38.73 0 top
R11  45.09,46.99 0 top
R12  28.51,48.51 180 top
R14  13.72,27.49 180 top
R15  43.81,43.81 270 top
R16  43.81,35.56 270 top
R17  43.81,27.31 270 top
R18  43.81,19.05 270 top
R19  23.88,41.5 0 top
R20  23.88,39.78 0 top
R21  23.9,32.87 0 top
R22  23.9,34.6 0 top
R23  39.85,21.27 0 top
SW1  43.66,12.06 0 top
U4  32.91,40.96 315 top
U$15  [HEEPLOGOSMALL]  37.15,46.04 0 top
U$19  19.05,13.18 0 top
X1  17.3,5.71 0 top
X2  10.86,38.1 90 top
X3  28.91,5.71 0 top
X4  -3.18,23.5 0 top
Y4  37.52,11.97 270 top

### Tracks (layer width: path | path; a pad name or v marks a point on that pad's centre or on a via)
0/RX
  Top 0.254: J17.2 52.27,9 44.6,16.67 34.95,16.67 34.21,17.41 34.21,18.26 IC2.20
1/TX
  Top 0.254: IC2.21 34.71,18.26 34.71,17.49 35.12,17.08 44.83,17.08 55.77,6.14 J17.1 55.56,5.71
2/SDA
  Top 0.254: IC2.19 33.71,18.26 33.71,17.34 34.79,16.27 37.39,16.27 40.53,13.12 J15.1
3/SCL
  Top 0.254: J15.2 39.05,8.37 39.05,14.03 37.22,15.86 34.62,15.86 33.21,17.26 33.21,18.26 IC2.18
13
  Top 0.254: IC2.32 38.15,23.83 D5.A
+3V3  (via drill 0.35)
  Top 0.254: C33.1 20.97,48.95 C11.1 | C24.1 v26.73,31.49 | R7.1 R3.2 | U4.28 33.19,38.91 33.19,48.24 31.75,49.69 | L1.P$2 21.29,21.08 24.77,21.08 v26.16,22.46 26.16,19.68 27.24,18.59 28.29,18.59 v28.57,18.48 | R7.1 36.48,32.37 v36.14,32.7 | R7.1 35.66,30.73 35.66,29.13 35.12,28.6 35.12,25.49 | IC2.34 35.12,25.49 | IC2.33 | IC2.33 36.1,24.51 35.12,25.49 | v37,20.48 36.78,20.25 36.78,20.09 36.52,19.83 IC2.24 | v36.82,24.62 36.53,24.33 IC2.33 | IC2.44 27.94,25.3 v27.67,25.04 | v28.2,22.3 28.2,22.12 28.16,22.09 | IC2.14 31.12,17.86 v31.51,17.47 | C11.1 L2.1 | C11.1 23.28,50.18 24.06,50.96 25.4,50.96 26.66,49.7 28.49,49.7 28.51,49.69 31.75,49.69 | 31.75,49.69 35.4,49.69 36.12,48.97 C3.1
  Top 0.305: IC2.6 28.42,21.83 28.16,22.09 25.36,24.89 18.7,24.89 v18.57,24.76 | R1.1 19.26,48.95 20.97,48.95 | U$19.P5 18.3,10.92
  Top 0.35: 35.88,36.22 U4.28
  Top 0.406: v35.88,35.88 35.88,36.22 | 24.45,13.33 24.45,12.54 22.54,10.64 18.57,10.64 18.29,10.92 18.3,10.92
  Top 0.508: 24.92,6.21 25.25,5.88
  Top 0.813: C13.1 C12.1 | v26.73,31.49 C23.1 28.85,32.12 28.85,32.28 29.35,32.77 30.25,32.77 30.5,33.02 v30.64,33.02 | 25.25,5.88 X3.3 27.32,3.81 46.35,3.81 47.52,4.97 J14.1 49.42,3.81 61.28,3.81 62.76,5.29 J16.1 | 25.25,5.88 24.45,6.68 24.45,13.33 24.45,20 23.32,21.13 L1.P$2 | X1.3 15.71,3.81 23.5,3.81 25.25,5.56 25.25,5.88
  Top 1.27: L1.P$2 19.42,21.71 C13.1
  Bottom 0.254: v36.14,32.7 35.29,33.55 35.29,34.04 | v37,20.48 37,24.43 v36.82,24.62 | v27.67,25.04 28.2,24.51 v28.2,22.3 28.03,22.46 v26.16,22.46 | v31.51,17.47 30.51,18.48 v28.57,18.48 | R2.1 17.55,25.78 v18.57,24.76
  Bottom 0.305: v18.57,24.76 v18.57,24.77
  Bottom 0.813: v26.73,31.49 26.7,31.49 23.4,28.19 20.73,28.19 v18.57,24.77 | v30.64,33.02 31.66,34.04 35.29,34.04 35.81,34.56 35.81,35.81 v35.88,35.88
  other vias: 14.13,21.75 17.55,27.06 36.12,48.87
A0  (via drill 0.35)
  Top 0.254: IC2.36 34.12,26.1 v34.19,26.16
  Bottom 0.254: v34.19,26.16 27.62,26.16 27.07,25.61 27.07,23.89 26.25,23.07 25.91,23.07 25.55,22.71 25.55,22.21 26.04,21.73 26.04,18.1 26.9,17.23 26.9,10.25 28.91,8.23 X3.2
A1  (via drill 0.35)
  Top 0.254: IC2.37 33.62,25.87 33.58,25.91 33.58,26.7 v33.65,26.77
  Bottom 0.254: v33.65,26.77 27.59,26.77 26.66,25.84 26.66,24.44 25.14,22.92 25.14,22.04 25.63,21.56 25.63,17.93 26.49,17.07 26.49,10.08 26.67,9.9 26.67,8.57 25.72,7.62 19.21,7.62 X1.2
ACTLED  (via drill 0.35)
  Top 0.254: U4.27 34.25,37.15 33.66,37.15 31.12,34.61 v29.21,34.61
  Bottom 0.254: v29.21,34.61 20.18,34.61 20.15,34.64 19.65,34.64 17.81,36.48 15.59,36.48 15.24,36.83 15.24,39.05 12.7,41.59 10.21,41.59 9.61,42.18 X2.12
D+  (via drill 0.35)
  Top 0.254: IC2.4 29.05,22.92 27.94,22.92 25.34,25.52 v24.77,25.52 | v8.57,7.94 8.54,7.97 R5.1
  Bottom 0.254: v24.77,25.52 24.77,23.12 24.74,23.09 24.74,17.49 25.72,16.51 25.72,9.21 24.54,8.03 19.04,8.03 18.63,7.62 8.89,7.62 v8.57,7.94
D-  (via drill 0.35)
  Top 0.254: IC2.3 28.11,23.33 25.4,26.04 v25.4,26.13 | R4.1 11.02,8.26 v11.75,8.26
  Bottom 0.254: v11.75,8.26 18.69,8.26 18.87,8.43 23.99,8.43 25.08,9.53 25.08,16.57 24.16,17.5 24.16,25.77 24.51,26.13 v25.4,26.13
DRAIN1
  Top 1.27: D11.A 58.72,43.81 Q1.4
  Top 2.54: Q1.4 60.85,44.24 J2.2
DRAIN2
  Top 1.27: D8.A 58.74,34.84 Q3.4
  Top 2.54: Q3.4 59.17,35.99 J3.2
DRAIN3
  Top 1.27: D9.A 57.15,24.03 57.15,25.72 Q5.4
  Top 2.54: Q5.4 62.03,27.74 J4.2
DRAIN4
  Top 1.27: D10.A 58.74,16.09 Q6.4
  Top 2.54: Q6.4 63.61,19.48 J5.2
EN1  (via drill 0.35)
  Top 0.254: Q1.1 47.77,46.99 R11.2 45.94,45.08 D1.A 44.67,43.81 J1.1 | IC2.31 37.58,23.33 v37.69,23.22 | v38.91,28.64 39.78,29.51 v42.67,29.51
  Bottom 0.254: v42.67,29.51 42.67,42.58 J1.1 | v38.91,28.64 38.91,24.43 v37.69,23.22
EN2  (via drill 0.35)
  Top 0.254: J8.1 41.45,35.58 44.43,35.58 45.05,36.2 45.3,36.2 D2.A 45.94,36.82 R10.2 47.77,38.73 Q3.1 | IC2.30 37.23,22.83 v37.65,22.4
  Bottom 0.254: v37.65,22.4 37.86,22.61 37.94,22.61 39.62,24.3 39.62,29.09 41.43,30.9 J8.1
EN3  (via drill 0.35)
  Top 0.254: J9.1 44.67,27.31 D3.A 45.94,28.57 R9.2 46.83,29.59 Q5.1 | IC2.29 36.87,22.33 v37.82,21.38
  Bottom 0.254: v37.82,21.38 41.43,24.99 J9.1
EN4
  Top 0.254: Q6.1 46.83,21.33 R6.2 45.94,20.32 D4.A 45.5,20.1 44.43,19.03 41.45,19.03 J10.1 41.42,19.07 39.27,19.07 37.01,21.33 IC2.27
GND  (via drill 0.35)
  Top 0.152: IC2.THERMAL v34.05,20.4 | IC2.THERMAL 32.86,21.59 v33.97,21.59 | IC2.THERMAL 30.95,23.5 v30.8,23.5
  Top 0.254: U$19.P4 18.3,12.43 v18.57,12.7 | v31.43,48.42 31.34,48.51 R12.1 29.1,48.51 28.33,49.29 25.62,49.29 C11.2 24.73,49.89 23.9,49.06 23.9,47.55 C25.2 | IC2.5 32.12,22.33 IC2.THERMAL | IC2.43 30.72,25.21 30.72,24.79 32.62,22.88 IC2.THERMAL | IC2.35 34.62,23.83 IC2.THERMAL | IC2.23 35.12,19.33 v34.05,20.4 | IC2.15 31.71,18.45 31.71,18.87 32.62,19.77 v31.99,20 IC2.THERMAL | J6.P4 4.22,8.68 J6.P2 | SW1.3 43.65,12.87 v43.81,12.7 45.49,12.7 SW1.1
  Top 0.305: v19.53,13.65 19.3,13.88 U$19.P14 U$19.P15 | U$19.PAD 19.05,14.38 U$19.P15 | U$19.P15 18.8,13.88 v18.57,13.65
  Bottom 0.152: v31.99,20 33.57,21.59 v33.97,21.59 v34.61,22.23
  Bottom 0.254: v31.43,48.42 31.59,48.26 v34.29,48.26 | C21.2 21.2,27.06 21.27,26.99
  other vias: 19.53,12.7 21.13,27.06 19.36,28.76 14.13,19.85 21.13,47.25 29.21,40.64 29.84,41.27 30.48,41.91 31.12,42.54 31.75,43.18 32.38,43.81 32.38,42.54 31.75,41.91 31.12,41.27 30.48,40.64 29.84,40 30.48,39.37 31.12,40 31.75,40.64 32.38,41.27 32.38,40 31.75,39.37 31.12,38.73 31.75,38.1 32.38,38.73 32.38,37.46 33.02,38.1 33.97,39.05 34.61,38.42 35.24,39.05 34.61,39.69 33.97,40.32 34.61,40.96 33.97,41.59 34.61,42.23 33.97,42.86 34.61,43.5 33.97,44.13 35.24,42.86 35.24,41.59 35.24,40.32 35.88,39.69 36.51,40.32 35.88,40.96 36.51,41.59 35.88,42.23 37.15,40.96 32.78,20 47.31,44.77 48.26,44.77 49.21,44.77 49.21,43.81 49.21,42.86 48.26,42.86 48.26,43.81 47.31,43.81 47.31,42.86 47.31,35.88 48.26,35.88 49.21,35.88 49.21,34.92 49.21,33.97 48.26,33.97 48.26,34.92 47.31,34.92 47.31,33.97 47.31,26.67 48.26,26.67 49.21,26.67 49.21,25.72 49.21,24.77 48.26,24.77 48.26,25.72 47.31,25.72 47.31,24.77 47.31,17.46 48.26,17.46 49.21,17.46 49.21,16.51 49.21,15.56 48.26,15.56 48.26,16.51 47.31,16.51 47.31,15.56 19.05,15.4 20,15.56 19.05,16.35 20,16.35 20.95,16.35 37.52,11.97 13.59,10.79 12.91,17.24 16.83,19.69 16.83,18.73 14.13,18.73 14.61,15.88 14.61,14.92 13.65,14.92 13.65,15.88 12.7,15.88 13.18,18.73 12.22,18.73 12.54,19.69 12.7,12.7 11.75,12.7 11.75,13.65 10.79,13.65 10.79,12.7 9.84,12.7 9.84,13.65 17.08,10.16 17.08,9.21 18.03,9.21 18.99,9.21 18.03,10
  pour Top (rank 2): -8.1,55.88 12.07,55.88 12.07,48.89 55.4,48.89 55.24,8.89 73.98,8.89 73.98,-1.91 55.24,-1.91 -8.26,-0.64
  pour Bottom (rank 2): -8.1,56.83 55.4,56.83 55.24,9.84 55.24,8.89 73.98,8.89 73.98,-1.91 55.24,-1.91 -8.26,-0.64
INT  (via drill 0.35)
  Top 0.254: R3.1 39.63,31.46 v40.24,31.46 | v39.7,39.39 38.37,39.39 U4.36
  Bottom 0.254: v40.24,31.46 40.24,35.03 40.21,35.05 40.21,36.06 40.36,36.21 40.36,38.73 v39.7,39.39
LNKLED  (via drill 0.35)
  Top 0.254: v34.92,34.92 34.12,35.73 U4.25
  Bottom 0.254: 34.73,34.73 v34.92,34.92 30.39,34.92 29.46,34 21.48,34 20.15,32.67 19.34,32.67 18.07,33.94 16.8,33.94 16.22,34.52 16.22,34.9 14.61,36.51 14.61,39.11 12.53,41.19 10.39,41.19 7.81,38.61 7.81,33.59 6.78,32.55 X2.14 7.07,31.48
MISO  (via drill 0.35)
  Top 0.254: IC2.11 27.62,19.33 v27.49,19.2 | U4.34 38.5,37.85 38.56,37.85 39.63,36.78 v39.63,36.43 | J7.1 27.67,12.17 27.67,15.93 29.06,17.32 v29.06,17.35
  Bottom 0.254: v39.63,36.43 39.63,30.3 37.64,28.31 37.64,27.04 30.34,19.74 28.03,19.74 v27.49,19.2 27.97,18.73 27.97,18.23 28.32,17.87 28.55,17.87 v29.06,17.35
MOSI  (via drill 0.35)
  Top 0.254: IC2.10 27.17,19.83 v27.05,19.94 | U4.35 37.68,39.4 38.8,38.28 v39.75,38.28
  Bottom 0.254: v39.75,38.28 39.02,37.55 39.02,30.26 37.24,28.48 37.24,27.21 30.18,20.15 27.26,20.15 v27.05,19.94 27.05,19.62 26.89,19.45 26.89,18.68 J7.4
N$3  (via drill 0.35)
  Top 0.254: X2.13 8.82,31.97 8.82,31.5 11.75,28.58 17.37,28.58 R2.2
  other vias: 17.55,28.76
N$4  (via drill 0.35)
  Bottom 0.254: R1.2 14.75,47.22 14.52,47.45 9.5,47.45 X2.11
  other vias: 19.23,47.22
N$5
  Top 0.254: R15.2 44.02,42.77 D1.C
N$6
  Top 0.254: J6.3 4.74,12.39 6.3,12.39 8.03,10.67 R5.2
N$7
  Top 0.254: R16.2 45.52,34.71 D2.C
N$8
  Top 0.254: R17.2 45.52,26.46 D3.C
N$9
  Top 0.254: R18.2 45.52,18.2 D4.C
N$10
  Top 0.254: R23.2 40.7,22.98 D5.C
N$11
  Top 0.254: IC2.16 32.12,17.21 34.28,15.05 34.8,15.05 35.88,13.97 35.88,11.43 36.53,10.77 Y4.3
N$12
  Top 0.254: Y4.1 37.52,13.46 35.52,15.46 34.45,15.46 32.71,17.19 32.71,18.26 IC2.17
N$13
  Top 0.254: J6.2 6.03,13.03 6.05,13.03 7.94,13.03 R4.2
N$14
  Top 0.254: 21.05,12.93 U$19.P10 21.3,12.93 21.34,12.89 22.84,12.89 C14.1
N$16
  Top 0.254: C14.2 22.18,14.72 21.75,14.29 20.86,14.29 U$19.P12 U$19.P13 20.34,14.63 21.59,15.88 21.59,17.15 21.91,17.46 21.76,17.61 20.64,17.61
  Top 0.305: D6.C 16.61,14.92 U$19.P1 U$19.P16 18.3,16.87 19.05,17.62 19.06,17.61 20.64,17.61 L1.P$1
N$18
  Top 0.254: C21.1 22.2,29.83 22.2,30.01 22.56,30.37 23.7,30.37 23.91,30.58 23.91,36.97 24.09,37.15 26.08,37.15 26.37,36.86 26.57,36.86 26.71,36.72 29.73,36.72 U4.20
N$19
  Top 0.254: C22.1 20.23,27.93 21.75,27.93 22.12,28.3 23.7,28.3 23.86,28.46 23.86,29.96 25,29.96 25.94,30.91 25.94,32.17 27.94,34.17 27.94,34.92 28.29,35.27 28.83,35.27 28.99,35.43 29.87,35.43 U4.22
N$20
  Top 0.254: U4.10 26.67,44.73 26.67,47.94 27.24,48.51 R12.2
N$23  (via drill 0.35)
  Top 0.254: R22.1 R21.1
  Bottom 0.254: R21.1 23.05,29.42 C40.1
  other vias: 23.05,32.87 23.03,29.08
N$25
  Top 0.254: C35.1 35.27,31.89 | U4.31 36.24,37.95 36.9,37.29 36.9,35.46 34.88,33.45 C35.1 | 25MHZ.3 33.66,29.85 33.66,30.48 34.67,31.5 C35.1
N$26
  Top 0.254: C36.1 30.27,31.86 31.43,31.86 | 31.43,31.86 25MHZ.1 | U4.30 36.39,37.13 36.49,37.13 36.49,35.63 35.18,34.32 31.78,34.32 31.43,33.97 31.43,31.86
POE+  (via drill 0.35)
  Top 0.813: R14.1 15.43,27.49 v15.56,27.62 | v18.73,30.48 19.75,31.49 X2.9
  Top 1.016: X4.PWR 11.75,23.5 14.61,26.35 14.57,26.39 R14.1
  Bottom 0.813: v15.56,27.62 16.67,28.73 16.67,29.13 18.02,30.48 v18.73,30.48
RD+
  Top 0.254: C38.2 21.27,32.92 21.27,42.54 20,43.81 X2.1
RD-
  Top 0.254: C39.2 22.92,36.2 22.23,36.2 21.91,36.51 21.91,43.81 20.92,44.8 19.34,44.8 18.76,44.22 18.76,44.16 17.2,42.6 X2.2
RDN  (via drill 0.35)
  Top 0.254: R22.2 C39.1 | C39.1 24.94,36.51 | U4.5 30.3,44.67 29.73,45.23 29.73,45.63 v29.38,45.99 | v25.75,38.77 25.75,38.9 26.37,39.52 26.37,41.61 v26.67,41.91 | C39.1 25.54,36.33 v25.72,36.51
  Bottom 0.254: v26.67,41.91 26.67,45.09 27.33,45.75 28.83,45.75 29.06,45.99 v29.38,45.99 | v25.72,36.51 25.75,36.55 v25.75,38.77
RDP  (via drill 0.35)
  Top 0.254: C38.1 24.75,31.17 R21.2 26.45,34.57 v26.45,36.1 | U4.6 29.84,44.28 29.28,44.84 28.5,44.84 v28.26,45.09 | v26.67,38.1 26.67,39.24 26.78,39.35 26.78,40.96 27.32,41.5 v27.4,41.5
  Bottom 0.254: v28.26,45.09 27.4,44.23 v27.4,41.5 | v26.45,36.1 26.45,37.88 v26.67,38.1
RST  (via drill 0.35)
  Top 0.254: SW1.4 SW1.2 | v30.63,17.12 30.63,18.34 IC2.13
  Bottom 0.254: v30.63,17.12 30.63,16.66 32.65,14.63 32.65,12.28 J7.5 41.34,10.95 SW1.4
  other vias: 41.66,11.27
SCK  (via drill 0.35)
  Top 0.254: v26.9,21.77 26.94,21.72 26.94,20.91 27.52,20.33 IC2.9 | v38.31,37.24 36.94,38.61 U4.33
  Bottom 0.254: v38.31,37.24 38.31,30.37 36.83,28.89 36.83,27.37 30.01,20.55 27.3,20.55 26.94,20.91 26.94,21.72 v26.9,21.77 26.9,20.65 26.45,20.19 26.45,18.46 27.21,17.69 27.3,17.58 27.3,13.36 28.39,12.28 29.63,12.28 30.96,10.95 J7.3
SCSN_WIZ  (via drill 0.35)
  Top 0.254: IC2.8 27.88,20.83 v27.55,21.16 | U4.32 37.39,37.54 v37.39,32.88
  Bottom 0.254: v27.55,21.16 30.04,21.16 35.88,27 35.88,29.25 R7.2 37.39,30.76 v37.39,32.88
  other vias: 36.48,29.85
TDN  (via drill 0.35)
  Top 0.254: R20.1 v23.02,39.77 | U4.1 31.64,46.05 30.41,47.28 29.82,47.28 28.89,46.35 v28.58,46.35 | v26.04,42.54 25.76,42.27 v25.76,39.77
  Bottom 0.254: 25.8,39.77 v25.76,39.77 v23.02,39.77 22.17,39.77 20.15,37.75 17.49,37.75 X2.6 | v26.04,42.54 26.04,45.72 26.67,46.35 v28.58,46.35
TDP  (via drill 0.35)
  Top 0.254: v30.16,46.67 30.38,46.67 U4.2
  Bottom 0.254: v30.16,46.67 29.84,46.99 25.72,46.99 23.03,44.3 R19.1 20.27,38.73 X2.5
  other vias: 23.03,41.5
VBAT  (via drill 0.35)
  Top 0.305: U$19.P11 20.54,13.47 20.94,13.47 20.96,13.49 v21.59,13.49 | 17.1,12.93 U$19.P3 U$19.P2 | 17.1,12.93 16.83,12.93 | 16.83,12.93 16.67,12.93 | 16.67,12.93 16.35,12.93 | 16.35,12.93 15.86,12.93 15.67,13.11 C2.1 | U$19.P2 17.14,13.43 | 17.14,13.43 16.58,13.43 | 16.58,13.43 16.35,13.43 | 16.35,13.43 16.03,13.43 16.03,13.24 16.35,12.93 | U$19.P2 17.1,12.93 | 17.14,13.43 17.14,13.24 16.95,13.05 | 16.95,13.05 16.83,12.93 | 16.95,13.05 16.58,13.43 | 16.67,12.93 16.35,13.24 16.35,13.43
  Top 0.813: v13.34,38.1 13.34,42.6 15.66,45.25 15.66,50.48 C1.+
  Bottom 0.406: D7.C 16.44,11.03 | 16.44,11.03 20.4,11.03 21.59,12.22 v21.59,13.49 | 16.44,11.03 15.86,11.03 15.74,10.91
  Bottom 0.813: R14.2 13.84,28.47 14.63,28.47 15.66,29.5 15.66,31.01 13.34,33.34 v13.34,38.1
  Bottom 1.016: R14.2 15.59,24.13 15.59,13.02 | C4.1 15.74,10.91 15.59,11.06 15.59,13.02 | C2.1 15.67,13.1 15.59,13.02
  other vias: 11.39,15.13 12.87,27.49 59.21,40.16 60.01,40.16 60.8,40.16 59.21,39.37 60.01,39.37 60.8,39.37 59.21,38.58 60.01,38.58 60.8,38.58 59.05,31.12 59.85,31.12 60.64,31.12 59.05,30.32 59.85,30.32 60.64,30.32 59.05,29.53 59.85,29.53 60.64,29.53 59.21,21.91 60.01,21.91 60.8,21.91 59.21,21.11 60.01,21.11 60.8,21.11 59.21,20.32 60.01,20.32 60.8,20.32 59.21,12.38 60.01,12.38 60.8,12.38 59.21,11.59 60.01,11.59 60.8,11.59 59.21,10.79 60.01,10.79 60.8,10.79 15.62,10.79 15.67,13.18
  pour Top: 13.81,56.52 73.98,56.52 73.98,9.68 55.88,9.68 55.88,49.53 13.97,49.53
  pour Bottom: 55.72,56.52 73.98,56.52 73.98,9.68 55.88,9.68 55.88,49.53
VBUS
  Top 0.254: IC2.7 29.24,21.23 29.66,21.23 29.83,21.07 29.83,18.98 29.72,18.87 29.72,17.84 29.84,17.71 29.84,14.92 28.89,13.97 J7.2
  Top 0.305: IC2.7 29.1,21.37 28.23,21.37 25.79,23.81 13.97,23.81 12.38,22.23 12.38,20.64 11.43,19.69 11.43,17.32 10.62,16.51 9.07,16.51 D7.A 7.41,14.85 6.91,14.85 5.71,13.65 4.76,13.65 J6.1
VCCA  (via drill 0.35)
  Top 0.254: C9.1 R19.2 R20.2 C37.1 25.21,37.59 26.16,37.59 26.48,37.46 v27.62,37.46 27.94,37.78 28.34,37.78 | C9.1 C10.1 | C10.1 | C10.1 C25.1 L2.2 | C9.1 27.47,43.22 U4.11 28.28,42.51 28.84,41.95 29.07,41.95 29.8,42.68 | 29.8,42.68 29.8,42.82 29.84,42.86 29.8,42.91 29.24,43.47 U4.8 | U4.4 30.65,44.89 31.21,44.33 31.21,44.09 29.8,42.68 | U4.15 28.53,38.95 27.97,38.39 27.97,38.16 28.34,37.78 | 28.34,37.78 28.58,37.78 29.14,38.34 U4.17 | U4.21 29.6,35.88 v28.58,35.88
  Bottom 0.254: v28.58,35.88 28.58,36.51 v27.62,37.46
WIZ_RST  (via drill 0.35)
  Top 0.254: U4.37 38.89,43.05 38.89,43.66 | IC2.22 35.37,18.1 v35.37,17.69 | v43.52,40.66 41.89,40.66 38.89,43.66 | 38.89,43.66 36.44,46.11 R8.1
  Bottom 0.254: v43.52,40.66 43.28,40.41 43.28,25.59 v35.37,17.69 35.37,18.07
  other vias: 36.44,47.31

### Text on the board
tPlace: 24V Passive PoE / Ultimate Maglock | GND | VIN | 1 | + - | 2 | + - | FUSE | 13 | 3 | + - | 4 | + - | RESET | 3v3 A1 GND | 3v3 A0 GND | SCL SDA GND 3v3 | RX TX GND 3v3
bPlace: 1 | + - | 2 | + - | 24V / Pre-Fuse | GND | 3 | + - | 4 | + -